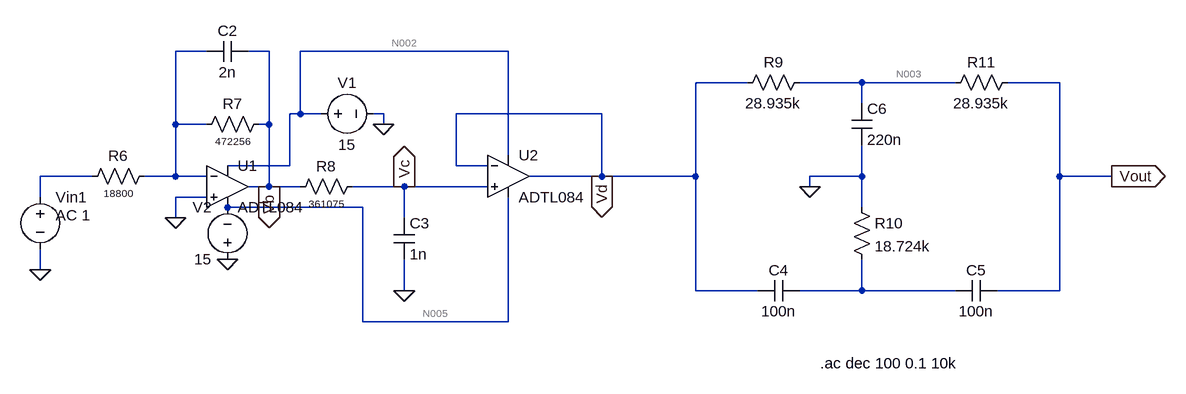
[diagram p0: schematic Combined Circuit.asc]
Combined Circuit.asc, the LTspice schematic file:
Version 4
SHEET 1 1824 680
WIRE 224 -32 176 -32
WIRE 320 -32 288 -32
WIRE 688 -32 368 -32
WIRE 1056 16 976 16
WIRE 1232 16 1136 16
WIRE 1376 16 1232 16
WIRE 1536 16 1456 16
WIRE 1232 48 1232 16
WIRE 368 64 368 -32
WIRE 368 64 352 64
WIRE 400 64 368 64
WIRE 496 64 480 64
WIRE 832 64 608 64
WIRE 176 80 176 -32
WIRE 224 80 176 80
WIRE 320 80 320 -32
WIRE 320 80 304 80
WIRE 496 80 496 64
WIRE 688 128 688 -32
WIRE 352 144 352 64
WIRE 352 144 256 144
WIRE 608 144 608 64
WIRE 656 144 608 144
WIRE 48 160 -32 160
WIRE 176 160 176 80
WIRE 176 160 128 160
WIRE 224 160 176 160
WIRE 832 160 832 64
WIRE 832 160 720 160
WIRE 976 160 976 16
WIRE 976 160 832 160
WIRE 1232 160 1232 112
WIRE 1232 160 1152 160
WIRE 1536 160 1536 16
WIRE 1616 160 1536 160
WIRE 320 176 320 80
WIRE 320 176 288 176
WIRE 368 176 320 176
WIRE 528 176 448 176
WIRE 656 176 528 176
WIRE 1152 176 1152 160
WIRE -32 192 -32 160
WIRE 224 192 176 192
WIRE 464 208 256 208
WIRE 1232 208 1232 160
WIRE 176 224 176 192
WIRE 528 224 528 176
WIRE -32 304 -32 272
WIRE 528 336 528 288
WIRE 976 336 976 160
WIRE 1072 336 976 336
WIRE 1232 336 1232 288
WIRE 1232 336 1136 336
WIRE 1376 336 1232 336
WIRE 1536 336 1536 160
WIRE 1536 336 1440 336
WIRE 464 384 464 208
WIRE 688 384 688 192
WIRE 688 384 464 384
FLAG -32 304 0
FLAG 176 224 0
FLAG 528 336 0
FLAG 256 288 0
FLAG 496 80 0
FLAG 1152 176 0
FLAG 1616 160 Vout
IOPIN 1616 160 Out
FLAG 832 160 Vd
IOPIN 832 160 Out
FLAG 528 176 Vc
IOPIN 528 176 Out
FLAG 320 176 Vb
IOPIN 320 176 Out
SYMBOL res 144 144 R90
WINDOW 0 0 56 VBottom 2
WINDOW 3 32 56 VTop 1
SYMATTR InstName R6
SYMATTR Value 18800
SYMBOL voltage -32 176 R0
WINDOW 3 34 75 Left 2
WINDOW 123 24 44 Left 2
WINDOW 39 0 0 Left 0
SYMATTR Value ""
SYMATTR Value2 AC 1
SYMATTR InstName Vin1
SYMBOL res 320 64 R90
WINDOW 0 0 56 VBottom 2
WINDOW 3 32 56 VTop 1
SYMATTR InstName R7
SYMATTR Value 472256
SYMBOL cap 288 -48 R90
WINDOW 0 0 32 VBottom 2
WINDOW 3 32 32 VTop 2
SYMATTR InstName C2
SYMATTR Value 2n
SYMBOL res 464 160 R90
WINDOW 0 0 56 VBottom 2
WINDOW 3 32 56 VTop 1
SYMATTR InstName R8
SYMATTR Value 361075
SYMBOL cap 512 224 R0
SYMATTR InstName C3
SYMATTR Value 1n
SYMBOL voltage 384 64 R270
WINDOW 0 32 56 VTop 2
WINDOW 3 -32 56 VBottom 2
WINDOW 123 0 0 Left 0
WINDOW 39 0 0 Left 0
SYMATTR InstName V1
SYMATTR Value 15
SYMBOL voltage 256 304 R180
WINDOW 0 24 96 Left 2
WINDOW 3 24 16 Left 2
SYMATTR InstName V2
SYMATTR Value 15
SYMBOL OpAmps\\ADTL084 256 112 R0
SYMATTR InstName U1
SYMBOL OpAmps\\ADTL084 688 96 R0
SYMATTR InstName U2
SYMBOL res 1152 0 R90
WINDOW 0 0 56 VBottom 2
WINDOW 3 32 56 VTop 2
SYMATTR InstName R9
SYMATTR Value 28.935k
SYMBOL cap 1216 48 R0
SYMATTR InstName C6
SYMATTR Value 220n
SYMBOL res 1216 192 R0
SYMATTR InstName R10
SYMATTR Value 18.724k
SYMBOL cap 1072 352 R270
WINDOW 0 32 32 VTop 2
WINDOW 3 0 32 VBottom 2
SYMATTR InstName C4
SYMATTR Value 100n
SYMBOL cap 1376 352 R270
WINDOW 0 32 32 VTop 2
WINDOW 3 0 32 VBottom 2
SYMATTR InstName C5
SYMATTR Value 100n
SYMBOL res 1472 0 R90
WINDOW 0 0 56 VBottom 2
WINDOW 3 32 56 VTop 2
SYMATTR InstName R11
SYMATTR Value 28.935k
TEXT 1168 448 Left 2 !.ac dec 100 0.1 10k

The netlist it stands for:
* Combined Circuit.asc
R6 N001 N004 18800
Vin1 N004 0 AC 1
R7 Vb N001 472256
C2 Vb N001 2n
R8 Vc Vb 361075
C3 Vc 0 1n
V1 N002 0 15
V2 0 N005 15
XU1 0 N001 N002 N005 Vb ADTL084  ; pins In+ In- V+ V- OUT
XU2 Vc Vd N002 N005 Vd ADTL084  ; pins In+ In- V+ V- OUT
R9 N003 Vd 28.935k
C6 N003 0 220n
R10 0 N006 18.724k
C4 Vd N006 100n
C5 N006 Vout 100n
R11 Vout N003 28.935k
.ac dec 100 0.1 10k
.lib ADTL084.lib
.backanno
.end

* Results of the author's LTspice run, read from the files saved beside the schematic
* Operating Point, zero values left out:
*   V(vb) = 944.5 nV
*   V(vc) = 222.3 nV
*   V(n002) = 15 V
*   V(n005) = -15 V
*   V(vd) = 222.3 nV
*   V(n003) = 222.3 nV
*   V(vout) = 222.3 nV
*   I(R7) = 2 pA
*   I(R8) = -2 pA
*   I(V1) = -10.25 mA
*   I(V2) = -10.25 mA
*   Ix(u1:1) = 2 pA
*   Ix(u1:2) = 2 pA
*   Ix(u1:3) = 5.124 mA
*   Ix(u1:4) = -5.124 mA
*   Ix(u1:5) = -4 pA
*   Ix(u2:1) = 2 pA
*   Ix(u2:2) = 2 pA
*   Ix(u2:3) = 5.124 mA
*   Ix(u2:4) = -5.124 mA
*   Ix(u2:5) = -2 pA
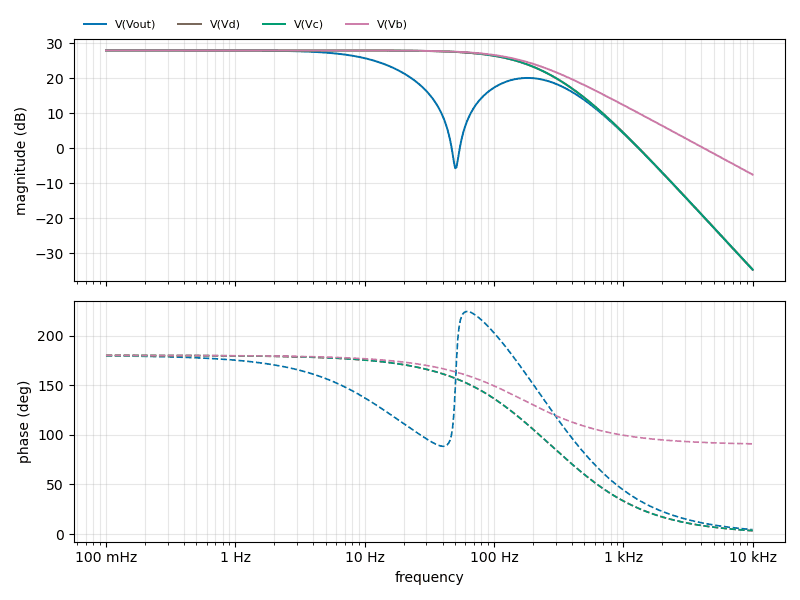
[diagram p1: AC Analysis of Combined Circuit.asc, plotted from the saved traces]
* AC Analysis, 1 run:
*   V(Vout): 28.00 dB at 100 mHz, -34.62 dB at 10 kHz, peak 28.00 dB at 100 mHz, 3 dB below the peak at 12.03 Hz
*   V(Vd): 28.00 dB at 100 mHz, -34.62 dB at 10 kHz, peak 28.00 dB at 100 mHz, 3 dB below the peak at 149.8 Hz
*   V(Vc): 28.00 dB at 100 mHz, -34.62 dB at 10 kHz, peak 28.00 dB at 100 mHz, 3 dB below the peak at 149.8 Hz
*   V(Vb): 28.00 dB at 100 mHz, -7.47 dB at 10 kHz, peak 28.00 dB at 100 mHz, 3 dB below the peak at 168.4 Hz